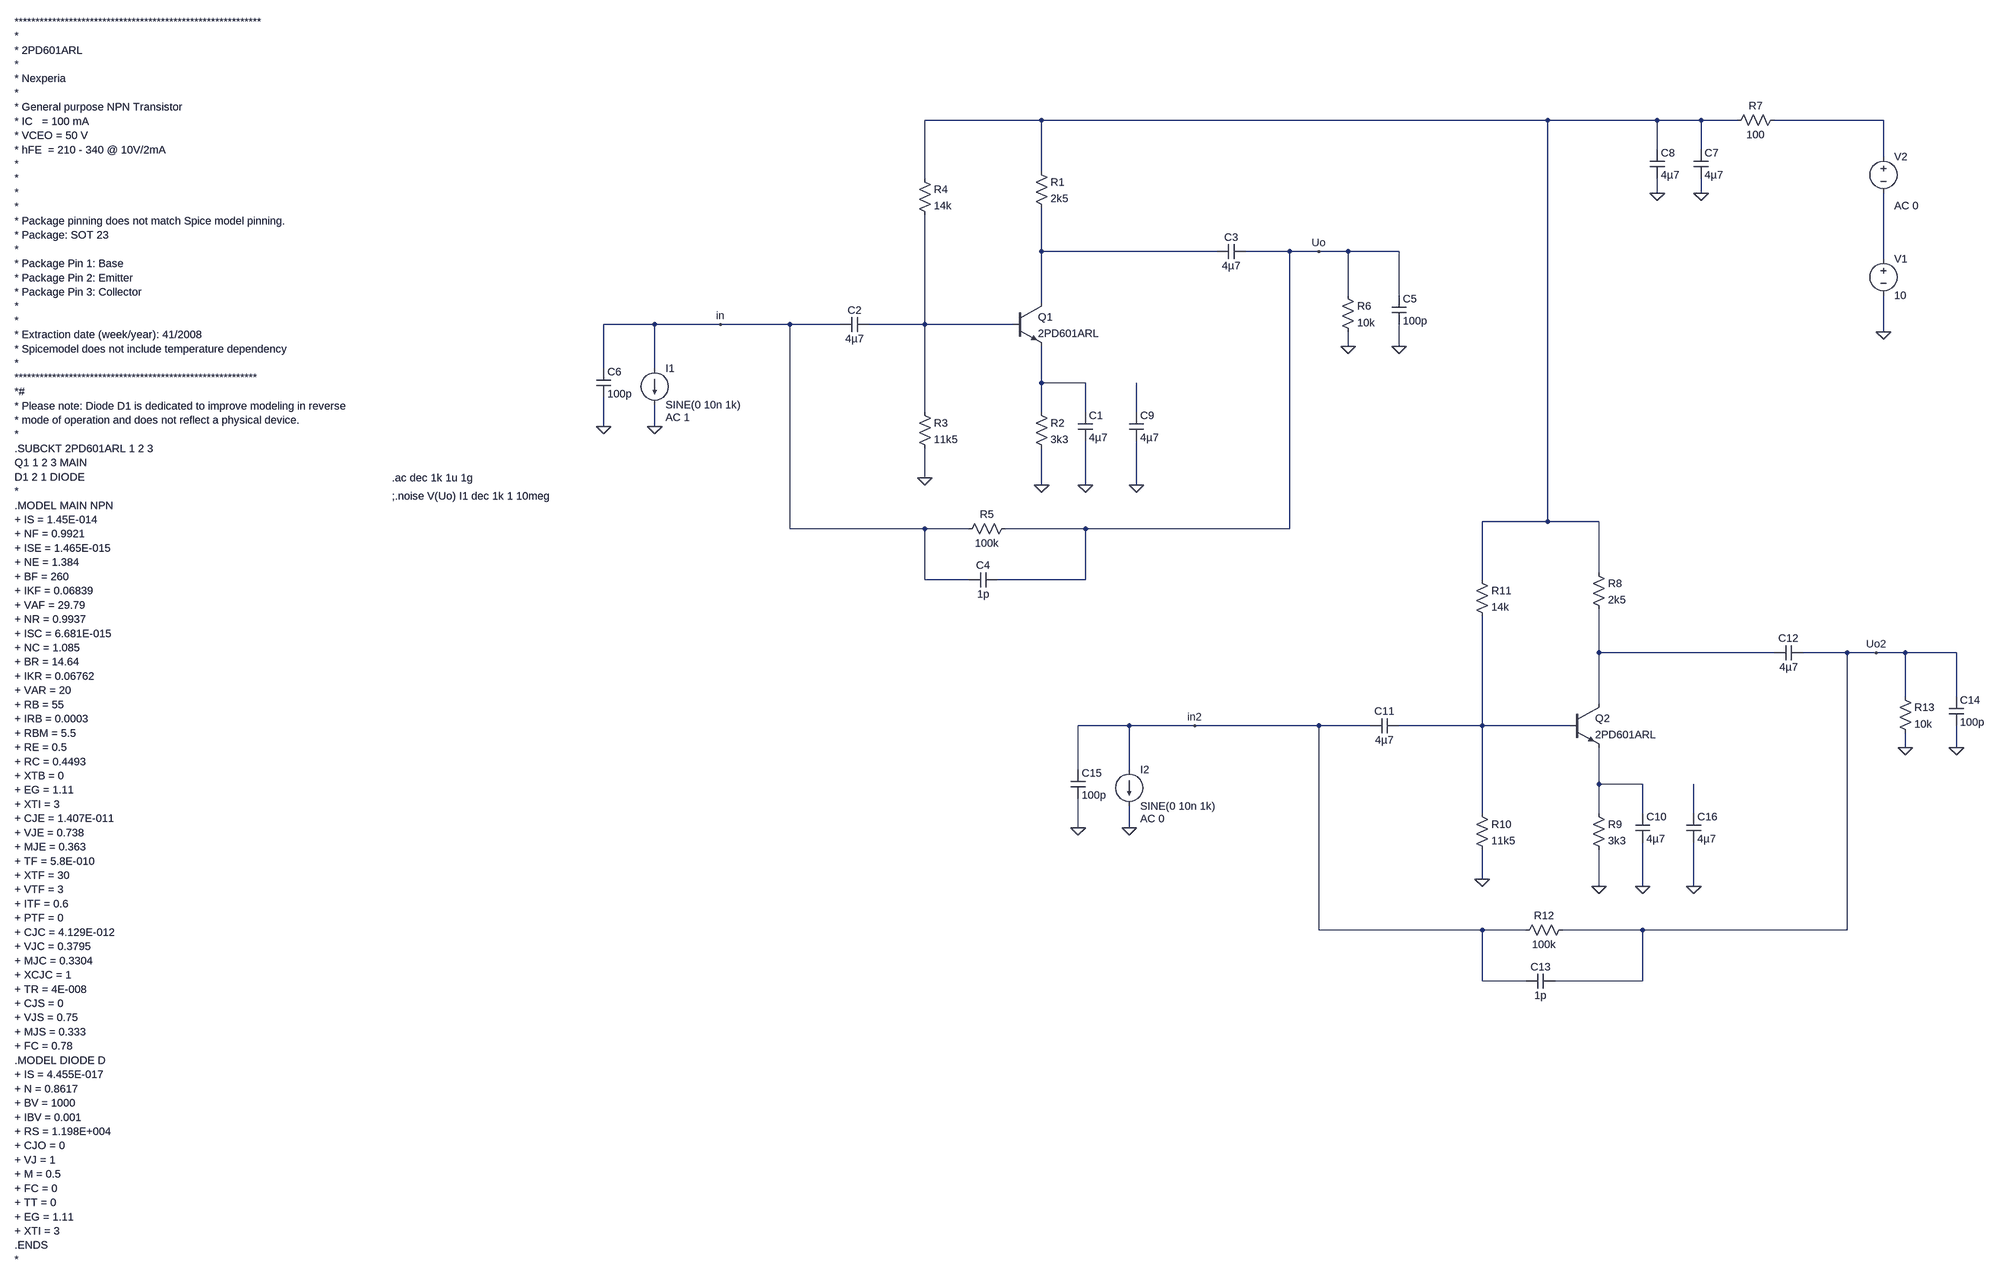
[diagram p0: schematic howNotToCrossTalk.asc]
howNotToCrossTalk.asc, the LTspice schematic file:
Version 4
SHEET 1 4084 2512
WIRE 2000 256 1744 256
WIRE 3120 256 2000 256
WIRE 3360 256 3120 256
WIRE 3456 256 3360 256
WIRE 3536 256 3456 256
WIRE 3856 256 3616 256
WIRE 3360 320 3360 256
WIRE 3456 320 3456 256
WIRE 3856 336 3856 256
WIRE 2000 368 2000 256
WIRE 1744 384 1744 256
WIRE 3360 416 3360 384
WIRE 3456 416 3456 384
WIRE 2000 544 2000 448
WIRE 2384 544 2000 544
WIRE 2544 544 2448 544
WIRE 2608 544 2544 544
WIRE 2672 544 2608 544
WIRE 2784 544 2672 544
WIRE 3856 560 3856 416
WIRE 2672 640 2672 544
WIRE 2784 640 2784 544
WIRE 2000 656 2000 544
WIRE 960 704 848 704
WIRE 1104 704 960 704
WIRE 1376 704 1104 704
WIRE 1488 704 1376 704
WIRE 1744 704 1744 464
WIRE 1744 704 1552 704
WIRE 1936 704 1744 704
WIRE 3856 720 3856 640
WIRE 2672 752 2672 720
WIRE 2784 752 2784 704
WIRE 848 800 848 704
WIRE 960 800 960 704
WIRE 2000 832 2000 752
WIRE 2096 832 2000 832
WIRE 1744 896 1744 704
WIRE 2000 896 2000 832
WIRE 2096 896 2096 832
WIRE 2208 896 2208 832
WIRE 848 928 848 864
WIRE 960 928 960 880
WIRE 1744 1040 1744 976
WIRE 2000 1056 2000 976
WIRE 2096 1056 2096 960
WIRE 2208 1056 2208 960
WIRE 3120 1136 3120 256
WIRE 3120 1136 2976 1136
WIRE 3232 1136 3120 1136
WIRE 1376 1152 1376 704
WIRE 1744 1152 1376 1152
WIRE 1840 1152 1744 1152
WIRE 2096 1152 1920 1152
WIRE 2544 1152 2544 544
WIRE 2544 1152 2096 1152
WIRE 3232 1248 3232 1136
WIRE 1744 1264 1744 1152
WIRE 1840 1264 1744 1264
WIRE 2096 1264 2096 1152
WIRE 2096 1264 1904 1264
WIRE 2976 1264 2976 1136
WIRE 3232 1424 3232 1328
WIRE 3616 1424 3232 1424
WIRE 3776 1424 3680 1424
WIRE 3840 1424 3776 1424
WIRE 3904 1424 3840 1424
WIRE 4016 1424 3904 1424
WIRE 3904 1520 3904 1424
WIRE 4016 1520 4016 1424
WIRE 3232 1536 3232 1424
WIRE 2192 1584 2080 1584
WIRE 2336 1584 2192 1584
WIRE 2608 1584 2336 1584
WIRE 2720 1584 2608 1584
WIRE 2976 1584 2976 1344
WIRE 2976 1584 2784 1584
WIRE 3168 1584 2976 1584
WIRE 3904 1632 3904 1600
WIRE 4016 1632 4016 1584
WIRE 2080 1680 2080 1584
WIRE 2192 1680 2192 1584
WIRE 3232 1712 3232 1632
WIRE 3328 1712 3232 1712
WIRE 2976 1776 2976 1584
WIRE 3232 1776 3232 1712
WIRE 3328 1776 3328 1712
WIRE 3440 1776 3440 1712
WIRE 2080 1808 2080 1744
WIRE 2192 1808 2192 1760
WIRE 2976 1920 2976 1856
WIRE 3232 1936 3232 1856
WIRE 3328 1936 3328 1840
WIRE 3440 1936 3440 1840
WIRE 2608 2032 2608 1584
WIRE 2976 2032 2608 2032
WIRE 3072 2032 2976 2032
WIRE 3328 2032 3152 2032
WIRE 3776 2032 3776 1424
WIRE 3776 2032 3328 2032
WIRE 2976 2144 2976 2032
WIRE 3072 2144 2976 2144
WIRE 3328 2144 3328 2032
WIRE 3328 2144 3136 2144
FLAG 2672 752 0
FLAG 2784 752 0
FLAG 2000 1056 0
FLAG 2096 1056 0
FLAG 1744 1040 0
FLAG 3856 720 0
FLAG 848 928 0
FLAG 960 928 0
FLAG 1104 704 in
FLAG 2608 544 Uo
FLAG 3360 416 0
FLAG 3456 416 0
FLAG 2208 1056 0
FLAG 3904 1632 0
FLAG 4016 1632 0
FLAG 3232 1936 0
FLAG 3328 1936 0
FLAG 2976 1920 0
FLAG 2080 1808 0
FLAG 2192 1808 0
FLAG 2336 1584 in2
FLAG 3840 1424 Uo2
FLAG 3440 1936 0
SYMBOL npn 1936 656 R0
SYMATTR InstName Q1
SYMATTR Value 2PD601ARL
SYMATTR Prefix X
SYMBOL res 1984 352 R0
SYMATTR InstName R1
SYMATTR Value 2k5
SYMBOL res 1984 880 R0
SYMATTR InstName R2
SYMATTR Value 3k3
SYMBOL cap 2080 896 R0
SYMATTR InstName C1
SYMATTR Value 4µ7
SYMBOL res 1728 880 R0
SYMATTR InstName R3
SYMATTR Value 11k5
SYMBOL res 1728 368 R0
SYMATTR InstName R4
SYMATTR Value 14k
SYMBOL cap 1552 688 R90
WINDOW 0 0 32 VBottom 2
WINDOW 3 32 32 VTop 2
SYMATTR InstName C2
SYMATTR Value 4µ7
SYMBOL cap 2448 528 R90
WINDOW 0 0 32 VBottom 2
WINDOW 3 32 32 VTop 2
SYMATTR InstName C3
SYMATTR Value 4µ7
SYMBOL cap 1904 1248 R90
WINDOW 0 0 32 VBottom 2
WINDOW 3 32 32 VTop 2
SYMATTR InstName C4
SYMATTR Value 1p
SYMBOL res 1936 1136 R90
WINDOW 0 0 56 VBottom 2
WINDOW 3 32 56 VTop 2
SYMATTR InstName R5
SYMATTR Value 100k
SYMBOL res 2656 624 R0
SYMATTR InstName R6
SYMATTR Value 10k
SYMBOL cap 2768 640 R0
SYMATTR InstName C5
SYMATTR Value 100p
SYMBOL voltage 3856 544 R0
WINDOW 123 0 0 Left 0
WINDOW 39 0 0 Left 0
SYMATTR InstName V1
SYMATTR Value 10
SYMBOL voltage 3856 320 R0
WINDOW 3 24 96 Invisible 2
WINDOW 123 24 124 Left 2
WINDOW 39 0 0 Left 0
SYMATTR Value 0
SYMATTR Value2 AC 0
SYMATTR InstName V2
SYMBOL current 960 800 R0
WINDOW 123 24 108 Left 2
WINDOW 39 0 0 Left 0
SYMATTR Value2 AC 1
SYMATTR InstName I1
SYMATTR Value SINE(0 10n 1k)
SYMBOL cap 832 800 R0
SYMATTR InstName C6
SYMATTR Value 100p
SYMBOL res 3632 240 R90
WINDOW 0 0 56 VBottom 2
WINDOW 3 32 56 VTop 2
SYMATTR InstName R7
SYMATTR Value 100
SYMBOL cap 3440 320 R0
SYMATTR InstName C7
SYMATTR Value 4µ7
SYMBOL cap 3344 320 R0
SYMATTR InstName C8
SYMATTR Value 4µ7
SYMBOL cap 2192 896 R0
SYMATTR InstName C9
SYMATTR Value 4µ7
SYMBOL npn 3168 1536 R0
SYMATTR InstName Q2
SYMATTR Value 2PD601ARL
SYMATTR Prefix X
SYMBOL res 3216 1232 R0
SYMATTR InstName R8
SYMATTR Value 2k5
SYMBOL res 3216 1760 R0
SYMATTR InstName R9
SYMATTR Value 3k3
SYMBOL cap 3312 1776 R0
SYMATTR InstName C10
SYMATTR Value 4µ7
SYMBOL res 2960 1760 R0
SYMATTR InstName R10
SYMATTR Value 11k5
SYMBOL res 2960 1248 R0
SYMATTR InstName R11
SYMATTR Value 14k
SYMBOL cap 2784 1568 R90
WINDOW 0 0 32 VBottom 2
WINDOW 3 32 32 VTop 2
SYMATTR InstName C11
SYMATTR Value 4µ7
SYMBOL cap 3680 1408 R90
WINDOW 0 0 32 VBottom 2
WINDOW 3 32 32 VTop 2
SYMATTR InstName C12
SYMATTR Value 4µ7
SYMBOL cap 3136 2128 R90
WINDOW 0 0 32 VBottom 2
WINDOW 3 32 32 VTop 2
SYMATTR InstName C13
SYMATTR Value 1p
SYMBOL res 3168 2016 R90
WINDOW 0 0 56 VBottom 2
WINDOW 3 32 56 VTop 2
SYMATTR InstName R12
SYMATTR Value 100k
SYMBOL res 3888 1504 R0
SYMATTR InstName R13
SYMATTR Value 10k
SYMBOL cap 4000 1520 R0
SYMATTR InstName C14
SYMATTR Value 100p
SYMBOL current 2192 1680 R0
WINDOW 123 24 108 Left 2
WINDOW 39 0 0 Left 0
SYMATTR Value2 AC 0
SYMATTR InstName I2
SYMATTR Value SINE(0 10n 1k)
SYMBOL cap 2064 1680 R0
SYMATTR InstName C15
SYMATTR Value 100p
SYMBOL cap 3424 1776 R0
SYMATTR InstName C16
SYMATTR Value 4µ7
TEXT -912 40 Left 2 !***********************************************************\n*\n* 2PD601ARL\n*\n* Nexperia\n*\n* General purpose NPN Transistor\n* IC   = 100 mA\n* VCEO = 50 V \n* hFE  = 210 - 340 @ 10V/2mA\n*\n*\n*\n*\n* Package pinning does not match Spice model pinning.\n* Package: SOT 23\n* \n* Package Pin 1: Base\n* Package Pin 2: Emitter\n* Package Pin 3: Collector\n*\n*\n* Extraction date (week/year): 41/2008  \n* Spicemodel does not include temperature dependency\n*\n**********************************************************\n*#\n* Please note: Diode D1 is dedicated to improve modeling in reverse\n* mode of operation and does not reflect a physical device.\n*\n.SUBCKT 2PD601ARL 1 2 3\nQ1 1 2 3 MAIN\nD1 2 1 DIODE\n*\n.MODEL MAIN NPN \n+ IS = 1.45E-014 \n+ NF = 0.9921 \n+ ISE = 1.465E-015 \n+ NE = 1.384 \n+ BF = 260 \n+ IKF = 0.06839 \n+ VAF = 29.79 \n+ NR = 0.9937 \n+ ISC = 6.681E-015 \n+ NC = 1.085 \n+ BR = 14.64 \n+ IKR = 0.06762 \n+ VAR = 20 \n+ RB = 55 \n+ IRB = 0.0003 \n+ RBM = 5.5 \n+ RE = 0.5 \n+ RC = 0.4493 \n+ XTB = 0 \n+ EG = 1.11 \n+ XTI = 3 \n+ CJE = 1.407E-011 \n+ VJE = 0.738 \n+ MJE = 0.363 \n+ TF = 5.8E-010 \n+ XTF = 30 \n+ VTF = 3 \n+ ITF = 0.6 \n+ PTF = 0 \n+ CJC = 4.129E-012 \n+ VJC = 0.3795 \n+ MJC = 0.3304 \n+ XCJC = 1 \n+ TR = 4E-008 \n+ CJS = 0 \n+ VJS = 0.75 \n+ MJS = 0.333 \n+ FC = 0.78 \n.MODEL DIODE D \n+ IS = 4.455E-017 \n+ N = 0.8617 \n+ BV = 1000 \n+ IBV = 0.001 \n+ RS = 1.198E+004 \n+ CJO = 0 \n+ VJ = 1 \n+ M = 0.5 \n+ FC = 0 \n+ TT = 0 \n+ EG = 1.11 \n+ XTI = 3 \n.ENDS\n*
TEXT 184 1040 Left 2 !.ac dec 1k 1u 1g
TEXT 184 1080 Left 2 !;.noise V(Uo) I1 dec 1k 1 10meg

The netlist it stands for:
* howNotToCrossTalk.asc
XQ1 N003 N005 N006 2PD601ARL  ; pins C B E
R1 N001 N003 2k5
R2 N006 0 3k3
C1 N006 0 4µ7
R3 N005 0 11k5
R4 N001 N005 14k
C2 N005 in 4µ7
C3 Uo N003 4µ7
C4 Uo in 1p
R5 Uo in 100k
R6 Uo 0 10k
C5 Uo 0 100p
V1 N004 0 10
V2 N002 N004 0 AC 0
I1 in 0 SINE(0 10n 1k) AC 1
C6 in 0 100p
R7 N002 N001 100
C7 N001 0 4µ7
C8 N001 0 4µ7
C9 N007 0 4µ7
XQ2 N008 N009 N010 2PD601ARL  ; pins C B E
R8 N001 N008 2k5
R9 N010 0 3k3
C10 N010 0 4µ7
R10 N009 0 11k5
R11 N001 N009 14k
C11 N009 in2 4µ7
C12 Uo2 N008 4µ7
C13 Uo2 in2 1p
R12 Uo2 in2 100k
R13 Uo2 0 10k
C14 Uo2 0 100p
I2 in2 0 SINE(0 10n 1k) AC 0
C15 in2 0 100p
C16 N011 0 4µ7
***********************************************************
*
* 2PD601ARL
*
* Nexperia
*
* General purpose NPN Transistor
* IC   = 100 mA
* VCEO = 50 V
* hFE  = 210 - 340 @ 10V/2mA
*
*
*
*
* Package pinning does not match Spice model pinning.
* Package: SOT 23
*
* Package Pin 1: Base
* Package Pin 2: Emitter
* Package Pin 3: Collector
*
*
* Extraction date (week/year): 41/2008
* Spicemodel does not include temperature dependency
*
**********************************************************
*#
* Please note: Diode D1 is dedicated to improve modeling in reverse
* mode of operation and does not reflect a physical device.
*
.SUBCKT 2PD601ARL 1 2 3
Q1 1 2 3 MAIN
D1 2 1 DIODE
*
.MODEL MAIN NPN
+ IS = 1.45E-014
+ NF = 0.9921
+ ISE = 1.465E-015
+ NE = 1.384
+ BF = 260
+ IKF = 0.06839
+ VAF = 29.79
+ NR = 0.9937
+ ISC = 6.681E-015
+ NC = 1.085
+ BR = 14.64
+ IKR = 0.06762
+ VAR = 20
+ RB = 55
+ IRB = 0.0003
+ RBM = 5.5
+ RE = 0.5
+ RC = 0.4493
+ XTB = 0
+ EG = 1.11
+ XTI = 3
+ CJE = 1.407E-011
+ VJE = 0.738
+ MJE = 0.363
+ TF = 5.8E-010
+ XTF = 30
+ VTF = 3
+ ITF = 0.6
+ PTF = 0
+ CJC = 4.129E-012
+ VJC = 0.3795
+ MJC = 0.3304
+ XCJC = 1
+ TR = 4E-008
+ CJS = 0
+ VJS = 0.75
+ MJS = 0.333
+ FC = 0.78
.MODEL DIODE D
+ IS = 4.455E-017
+ N = 0.8617
+ BV = 1000
+ IBV = 0.001
+ RS = 1.198E+004
+ CJO = 0
+ VJ = 1
+ M = 0.5
+ FC = 0
+ TT = 0
+ EG = 1.11
+ XTI = 3
.ENDS
*
.ac dec 1k 1u 1g
;.noise V(Uo) I1 dec 1k 1 10meg
.backanno
.end